# Altium schematic sheet Reverse_Protection.SchDoc
size A4; SheetNumber: 2; SheetTotal: 12
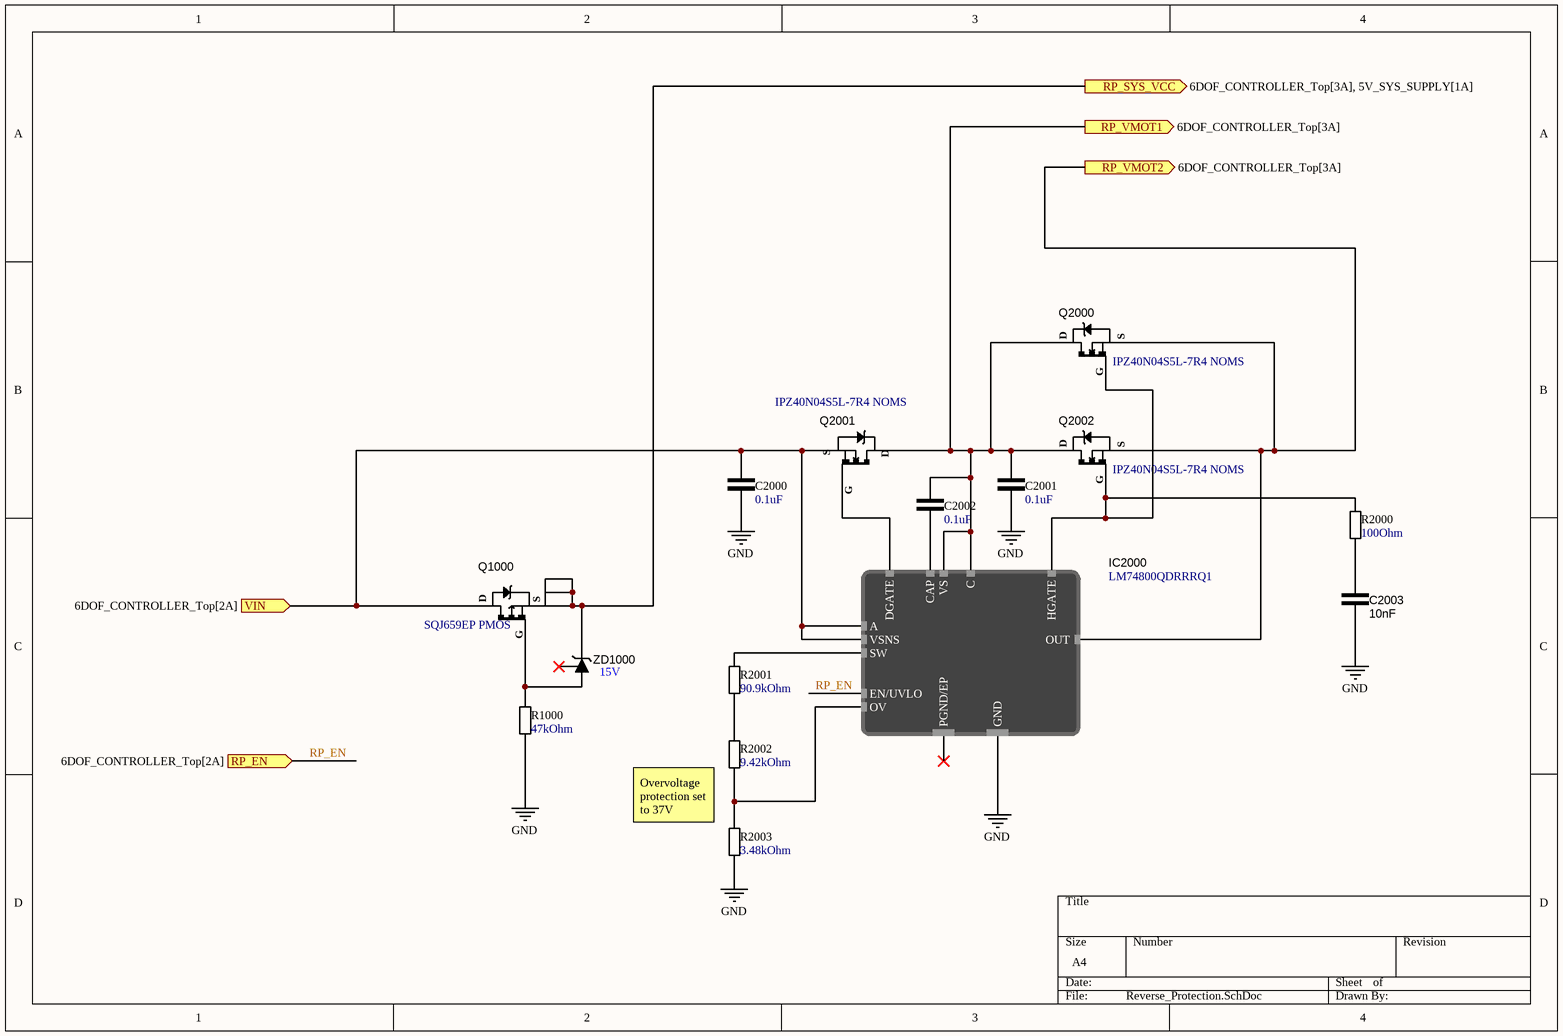
[diagram p0: Reverse_Protection.SchDoc]

## Parts
C2000  0.1uF  [CAP_0603]
C2001  0.1uF  [CAP_0603]
C2002  0.1uF  [CAP_0603]
C2003  10nF  [CAP_0603]
IC2000  LM74800QDRRRQ1  [SON50P300X80_HS-13N]
Q1000  SQJ659EP PMOS  [PowerPAK SO-8L SINGLE]
Q2000  IPZ40N04S5L-7R4 NOMS  [PG-TSDSON-8-32]
Q2001  IPZ40N04S5L-7R4 NOMS  [PG-TSDSON-8-32]
Q2002  IPZ40N04S5L-7R4 NOMS  [PG-TSDSON-8-32]
R1000  47kOhm  [RES_0603]
R2000  100Ohm  [RES_0603]
R2001  90.9kOhm  [RES_0603]
R2002  9.42kOhm  [RES_0603]
R2003  3.48kOhm  [RES_0603]
ZD1000  DZ23C15-E3-08 Zener Diode  [SOT95P245X96-3N]  (value not drawn)

## Ports
RP_EN (in, see 6DOF_CONTROLLER_Top[2A]), RP_SYS_VCC (out, see 6DOF_CONTROLLER_Top[3A], 5V_SYS_SUPPLY[1A]), RP_VMOT1 (out, see 6DOF_CONTROLLER_Top[3A]), RP_VMOT2 (out, see 6DOF_CONTROLLER_Top[3A]), VIN (in, see 6DOF_CONTROLLER_Top[2A])

## Nets
GND: C2000.1 C2001.1 C2003.1 IC2000.7(GND) R1000.1 R2003.1
RP_EN: IC2000.6(EN/UVLO) ; port RP_EN
RP_SYS_VCC: Q1000.S(S1) ZD1000.3(Cathode) ; port RP_SYS_VCC
RP_VMOT1: C2001.2 C2002.2 IC2000.10(VS) IC2000.12(C) Q2000.D(Drain) Q2001.D(Drain) Q2002.D(Drain) ; port RP_VMOT1
RP_VMOT2: IC2000.9(OUT) Q2000.S(Source) Q2002.S(Source) ; port RP_VMOT2
VIN: C2000.2 IC2000.2(A) IC2000.3(VSNS) Q1000.D Q2001.S(Source) ; port VIN
NetC2002_1: C2002.1 IC2000.11(CAP)
NetC2003_2: C2003.2 R2000.1
NetIC2000_1: IC2000.1(DGATE) Q2001.G(Gate)
NetIC2000_4: IC2000.4(SW) R2001.2
NetIC2000_5: IC2000.5(OV) R2002.1 R2003.2
NetIC2000_8: IC2000.8(HGATE) Q2000.G(Gate) Q2002.G(Gate) R2000.2
NetQ1000_G: Q1000.G R1000.2 ZD1000.1(Anode)
NetR2001_1: R2001.1 R2002.2

Not connected (* = marked no-connect by the designer): IC2000 13(PGND/EP)*; ZD1000 2(Anode)*

## Notes on the sheet
- (near ZD1000) 15V
- Overvoltage protection set to 37V

## Library data of the parts
C2000-C2002 = C000018: 0.1 µF ±10% 50V Ceramic Capacitor X7R 0603 (1608 Metric); ComponentLink1Description: DigiKey; ComponentLink1URL: https://www.digikey.com/en/products/detail/samsung-electro-mechanics/CL10B104KB8NNNC/3886658; DigiKey Part Number: 1276-1000-1-ND; capacitance: 0.1uF
C2003 = C000034: 10000 pF ±10% 50V Ceramic Capacitor X7R 0603 (1608 Metric); ComponentLink1Description: DigiKey; ComponentLink1URL: https://www.digikey.com/en/products/detail/kemet/C0603C103K5RACTU/411090; DigiKey Part Number: 399-C0603C103K5RACTUCT-ND; capacitance: 10nF
IC2000 = LM74800QDRRRQ1: OR Controller N+1 ORing Controller N-Channel 1:1 12-WSON (3x3); DigiKey Part Number: 296-LM74800QDRRRQ1CT-ND; ComponentLink1Description: DigiKey; ComponentLink1URL: https://www.digikey.com/en/products/detail/texas-instruments/LM74800QDRRRQ1/13627158; Mouser Part Number: 595-LM74800QDRRRQ1; ComponentLink2Description: Mouser; ComponentLink2URL: https://eu.mouser.com/ProductDetail/Texas-Instruments/LM74800QDRRRQ1?qs=KUoIvG%2F9IlYNgS7D9vQjYA%3D%3D
Q1000 = 00000005: P-Channel 60 V 52A (Tc) 83W (Tc) Surface Mount PowerPAK® SO-8; DigiKey Part Number: SQJ459EP-T1_GE3CT-ND; Mouser Part Number: 78-SQJ459EP-T2_BE3; ComponentLink1Description: DigiKey; ComponentLink1URL: https://www.digikey.com/en/products/detail/vishay-siliconix/SQJ459EP-T1-GE3/6708881; ComponentLink2Description: Mouser; ComponentLink2URL: https://eu.mouser.com/ProductDetail/Vishay-Siliconix/SQJ459EP-T2_BE3?qs=CiayqK2gdcKpg8h0vLRPjA%3D%3D
Q2000-Q2002 = 00000007: N-Channel 40 V 40A (Tc) 34W (Tc) Surface Mount PG-TSDSON-8; DigiKey Part Number: IPZ40N04S5L7R4ATMA1CT-ND; Mouser Part Number: 726-IPZ40N04S5L7R4AT; ComponentLink1Description: DigiKey; ComponentLink1URL: https://www.digikey.com/en/products/detail/infineon-technologies/IPZ40N04S5L7R4ATMA1/5960382; ComponentLink2Description: Mouser; ComponentLink2URL: https://eu.mouser.com/ProductDetail/Infineon-Technologies/IPZ40N04S5L7R4ATMA1?qs=RJIhqtkBntMJfptUOROQRQ%3D%3D; ComponentLink3Description: Footprint Drawing; ComponentLink3URL: https://www.infineon.com/cms/en/product/packages/PG-TSDSON/PG-TSDSON-8-32/#!downloads
R1000 = R000010: 47 kOhms ±1% 0.1W, 1/10W Chip Resistor 0603 (1608 Metric) Moisture Resistant Thick Film; ComponentLink1Description: DigiKey; ComponentLink1URL: https://www.digikey.com/en/products/detail/yageo/RC0603FR-0747KL/727253; resistance: 47kOhm; DigiKey Part Number: 311-47.0KHRCT-ND
R2000 = R000030: 100 Ohms ±1% 0.1W, 1/10W Chip Resistor 0603 (1608 Metric) Moisture Resistant Thick Film; ComponentLink1Description: DigiKey; ComponentLink1URL: https://www.digikey.com/en/products/detail/yageo/RC0603FR-07100RL/726888; resistance: 100Ohm; DigiKey Part Number: 311-100HRCT-ND
R2001 = R000027: 90.9 kOhms ±1% 0.1W, 1/10W Chip Resistor 0603 (1608 Metric) Automotive AEC-Q200 Thick Film; ComponentLink1Description: DigiKey; ComponentLink1URL: https://www.digikey.com/en/products/detail/panasonic-electronic-components/ERJ-3EKF9092V/196512; resistance: 90.9kOhm; DigiKey Part Number: P90.9KHCT-ND
R2002 = R000028: 9.42 kOhms ±1% 0.1W, 1/10W Chip Resistor 0603 (1608 Metric) Automotive AEC-Q200, Moisture Resistant Metal Film; ComponentLink1Description: DigiKey; ComponentLink1URL: https://www.digikey.com/en/products/detail/koa-speer-electronics-inc/RN73H1JTTD9421F25/10688584?s=N4IgjCBcoMxaBjKAzAhgGwM4FMA0IB7KAbXDBggF18AHAFyhAGU6AnASwDsBzEAX3xgAbPBBJIaLHkIkQMAJwAmACwjqIeoxYce-fIoAMADgCso8ZJz4ikUvIB0yxQAIA1gHkAFgFtMIdZqQIACqnOx07sgAstiomACurNh6IAC0iuZQbPHSNqRmlHwCIBm2IEmY7Jh0BKz%2BfEA; resistance: 9.42kOhm; DigiKey Part Number: 2019-RN73H1JTTD9421F25CT-ND
R2003 = R000029: 3.48 kOhms ±1% 0.1W, 1/10W Chip Resistor 0603 (1608 Metric) Automotive AEC-Q200 Thick Film; ComponentLink1Description: DigiKey; ComponentLink1URL: https://www.digikey.com/en/products/detail/stackpole-electronics-inc/RMCF0603FT3K48/1761028; resistance: 3.48kOhm; DigiKey Part Number: RMCF0603FT3K48CT-ND
ZD1000 = 00000006: Zener Diode Array 1 Pair Common Cathode 15 V 300 mW ±5% SOT-23-3; DigiKey Part Number: 112-DZ23C15-E3-08CT-ND; ComponentLink1Description: DigiKey; ComponentLink1URL: https://www.digikey.com/en/products/detail/vishay-general-semiconductor-diodes-division/DZ23C15-E3-08/4831460